# EAGLE schematic 208_humidity_Si7034 (EAGLE 7.4.0)
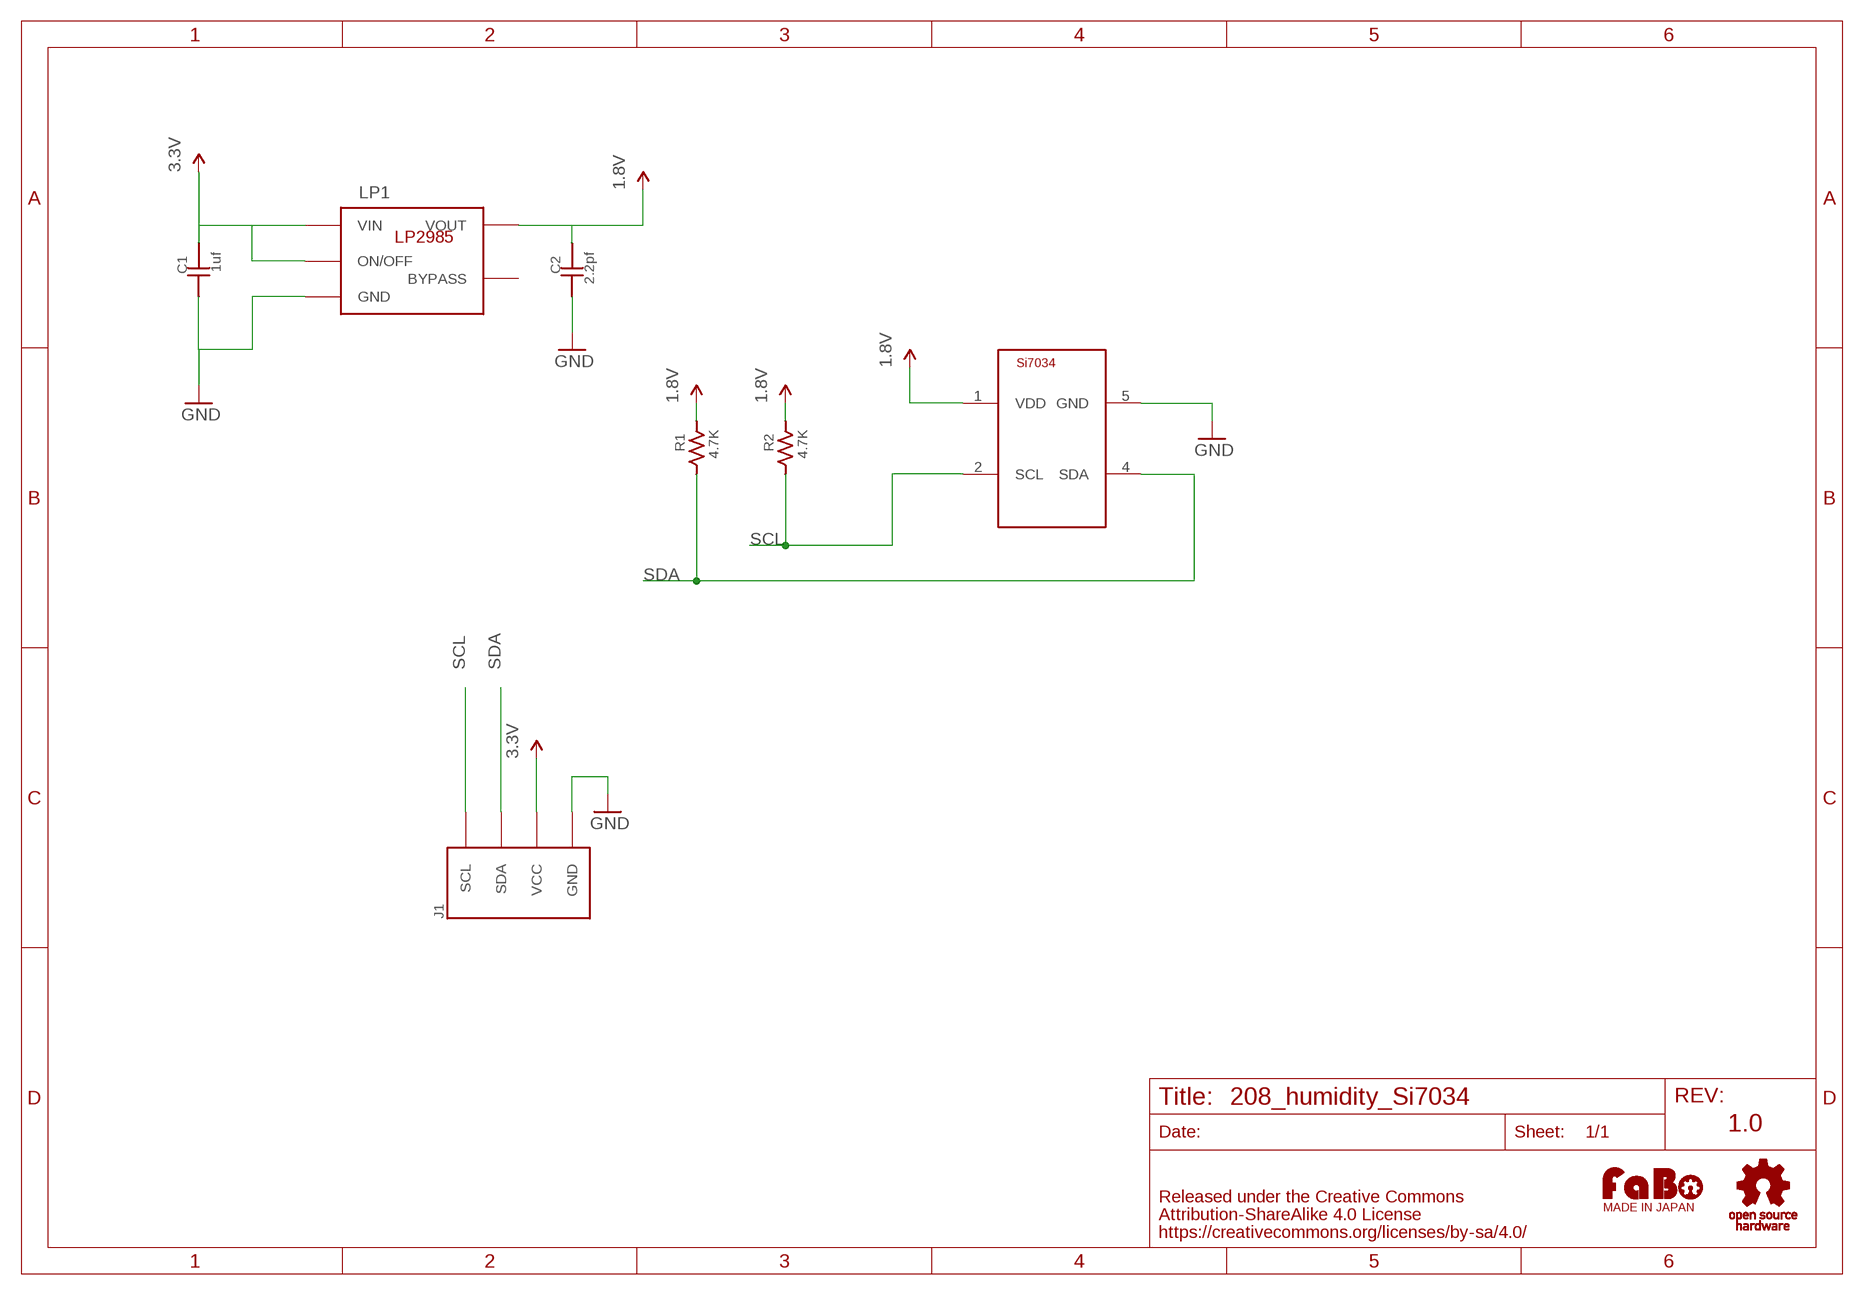
[diagram p0: schematic, sheet 1]

## Parts
C1  1uf  CAPACITOR0603  [0603]
C2  2.2pf  CAPACITOR0603  [0603]
J1  BRICK_I2C  [BRICK_I2C]
LP1  TI-LP2985-18DBVT  [TI-LP2985]
R1  4.7K  RESISTOR-0603  [0603]
R2  4.7K  RESISTOR-0603  [0603]
U$2  LOGO_FABO-M  [LOGO_FABO_M]
U$3  SILICONLABS-SI7034  [SILICONLABS-SI7034]
U$4  LOGO_OSHW_T-M  [LOGO_OSHW_T_M]

## Nets
1.8V: C2.2 LP1.5(VOUT) R1.2 R2.2 U$3.1(VDD)
3.3V: C1.2 J1.VCC LP1.1(VIN) LP1.3(ON/OFF)
GND: C1.1 C2.1 J1.GND LP1.2(GND) U$3.5(GND)
SCL: J1.SCL R2.1 U$3.2(SCL)
SDA: J1.SDA R1.1 U$3.4(SDA)
Unconnected: LP1.4(BYPASS)

## Notes on the sheet
- 1.0

## Library data of the parts
C1 C2 = FaBo-Capacitor:CAPACITOR: CAPACITOR
J1 = gclue:BRICK_I2C: FaBo Brick 4pin(I2C)
LP1 = FaBo-Supply:TI-LP2985: LP2985
R1 R2 = FaBo-Resistors:RESISTOR: RESISTOR
U$2 = FaBo:LOGO_FABO
U$3 = FaBo-Mems:SILICONLABS-SI7034
U$4 = gclue:LOGO_OSHW_T